# EAGLE design Adafruit NeoPixel Ring 24 B (EAGLE 6.3)
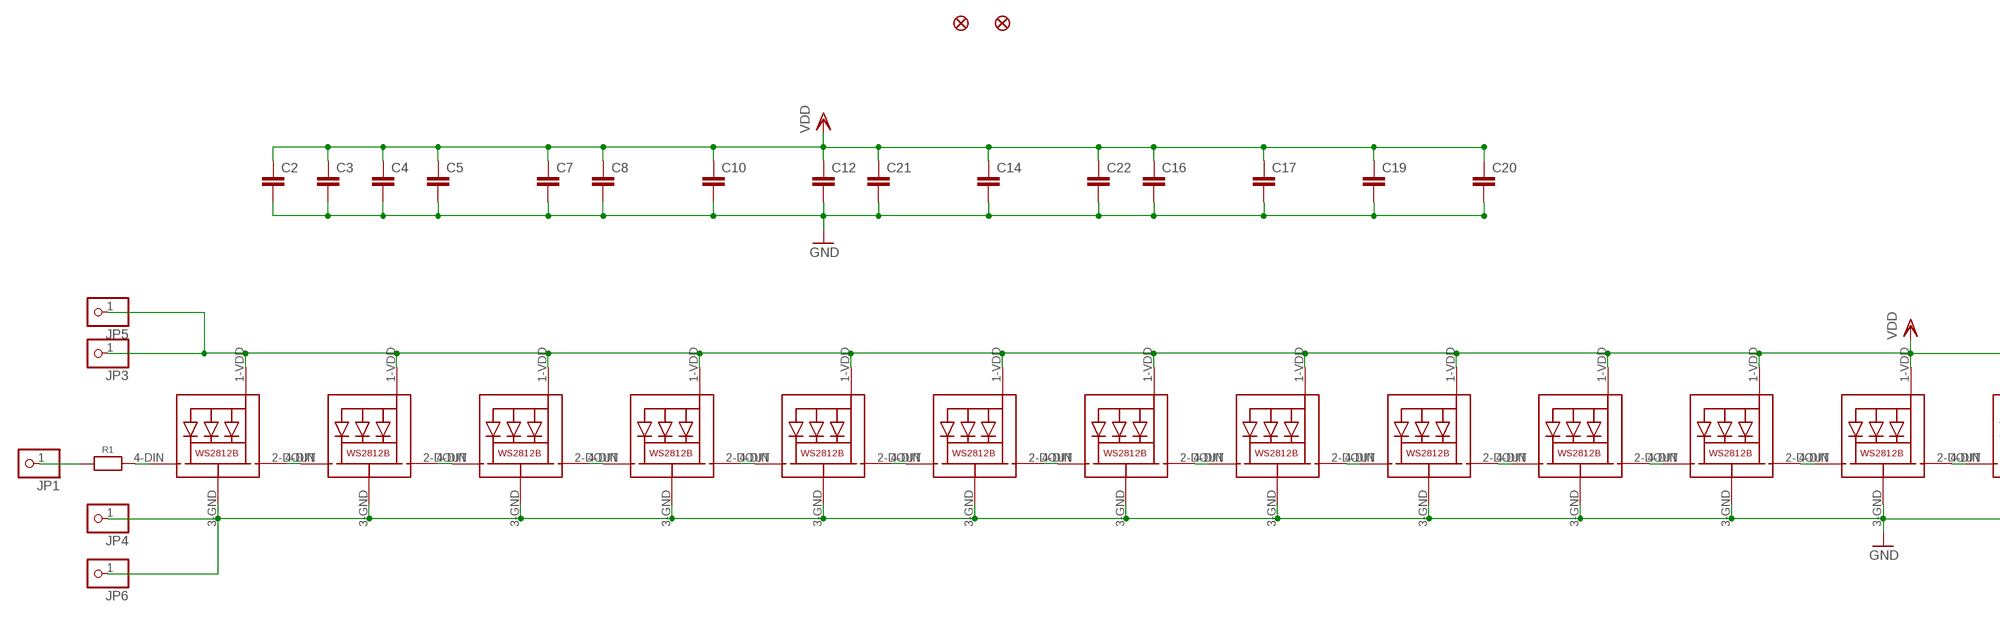
[diagram p0: schematic, sheet 1, part 1 of 2]
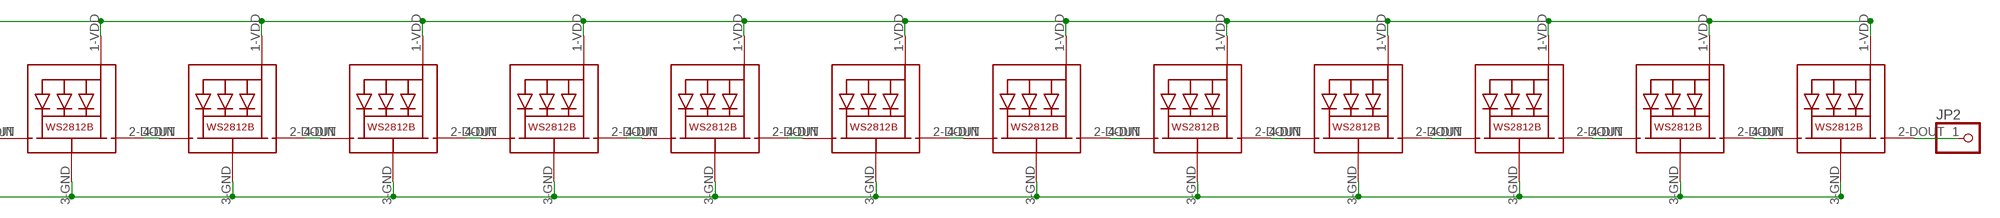
[diagram p1: schematic, sheet 1, part 2 of 2]

## Parts
C2  C-EUC0603  [C0603]
C3  C-EUC0603  [C0603]
C4  C-EUC0603  [C0603]
C5  C-EUC0603  [C0603]
C7  C-EUC0603  [C0603]
C8  C-EUC0603  [C0603]
C10  C-EUC0603  [C0603]
C12  C-EUC0603  [C0603]
C14  C-EUC0603  [C0603]
C16  C-EUC0603  [C0603]
C17  C-EUC0603  [C0603]
C19  C-EUC0603  [C0603]
C20  C-EUC0603  [C0603]
C21  C-EUC0603  [C0603]
C22  C-EUC0603  [C0603]
FID1  FIDUCIAL""  [FIDUCIAL_1MM]
FID2  FIDUCIAL""  [FIDUCIAL_1MM]
JP1  PINHD-1X1CB  [1X01-CLEANBIG]
JP2  PINHD-1X1CB  [1X01-CLEANBIG]
JP3  PINHD-1X1CB  [1X01-CLEANBIG]
JP4  PINHD-1X1CB  [1X01-CLEANBIG]
JP5  PINHD-1X1CB  [1X01-CLEANBIG]
JP6  PINHD-1X1CB  [1X01-CLEANBIG]
LED1  WS2812B5050  [WS2812B]
LED2  WS2812B5050  [WS2812B]
LED3  WS2812B5050  [WS2812B]
LED4  WS2812B5050  [WS2812B]
LED5  WS2812B5050  [WS2812B]
LED6  WS2812B5050  [WS2812B]
LED7  WS2812B5050  [WS2812B]
LED8  WS2812B5050  [WS2812B]
LED9  WS2812B5050  [WS2812B]
LED10  WS2812B5050  [WS2812B]
LED11  WS2812B5050  [WS2812B]
LED12  WS2812B5050  [WS2812B]
LED13  WS2812B5050  [WS2812B]
LED14  WS2812B5050  [WS2812B]
LED15  WS2812B5050  [WS2812B]
LED16  WS2812B5050  [WS2812B]
LED17  WS2812B5050  [WS2812B]
LED18  WS2812B5050  [WS2812B]
LED19  WS2812B5050  [WS2812B]
LED20  WS2812B5050  [WS2812B]
LED21  WS2812B5050  [WS2812B]
LED22  WS2812B5050  [WS2812B]
LED23  WS2812B5050  [WS2812B]
LED24  WS2812B5050  [WS2812B]
R1  RESISTOR_0603_NOOUT  [0603-NO]

## Nets
GND: C2.2 C3.2 C4.2 C5.2 C7.2 C8.2 C10.2 C12.2 C14.2 C16.2 C17.2 C19.2 C20.2 C21.2 C22.2 JP4.1 JP6.1 LED1.3-GND(GND) LED2.3-GND(GND) LED3.3-GND(GND) LED4.3-GND(GND) LED5.3-GND(GND) LED6.3-GND(GND) LED7.3-GND(GND) LED8.3-GND(GND) LED9.3-GND(GND) LED10.3-GND(GND) LED11.3-GND(GND) LED12.3-GND(GND) LED13.3-GND(GND) LED14.3-GND(GND) LED15.3-GND(GND) LED16.3-GND(GND) LED17.3-GND(GND) LED18.3-GND(GND) LED19.3-GND(GND) LED20.3-GND(GND) LED21.3-GND(GND) LED22.3-GND(GND) LED23.3-GND(GND) LED24.3-GND(GND)
N$1: LED1.2-DOUT(DO) LED2.4-DIN(DI)
N$2: LED2.2-DOUT(DO) LED3.4-DIN(DI)
N$3: LED3.2-DOUT(DO) LED4.4-DIN(DI)
N$4: LED4.2-DOUT(DO) LED5.4-DIN(DI)
N$5: LED5.2-DOUT(DO) LED6.4-DIN(DI)
N$6: LED6.2-DOUT(DO) LED7.4-DIN(DI)
N$7: LED7.2-DOUT(DO) LED8.4-DIN(DI)
N$8: LED8.2-DOUT(DO) LED9.4-DIN(DI)
N$9: LED9.2-DOUT(DO) LED10.4-DIN(DI)
N$10: LED10.2-DOUT(DO) LED11.4-DIN(DI)
N$11: LED11.2-DOUT(DO) LED12.4-DIN(DI)
N$12: LED12.2-DOUT(DO) LED13.4-DIN(DI)
N$13: LED13.2-DOUT(DO) LED14.4-DIN(DI)
N$14: LED14.2-DOUT(DO) LED15.4-DIN(DI)
N$15: LED15.2-DOUT(DO) LED16.4-DIN(DI)
N$16: LED16.2-DOUT(DO) LED17.4-DIN(DI)
N$17: LED17.2-DOUT(DO) LED18.4-DIN(DI)
N$18: LED18.2-DOUT(DO) LED19.4-DIN(DI)
N$19: LED19.2-DOUT(DO) LED20.4-DIN(DI)
N$20: LED20.2-DOUT(DO) LED21.4-DIN(DI)
N$21: LED21.2-DOUT(DO) LED22.4-DIN(DI)
N$22: LED22.2-DOUT(DO) LED23.4-DIN(DI)
N$23: LED23.2-DOUT(DO) LED24.4-DIN(DI)
N$24: JP2.1 LED24.2-DOUT(DO)
N$25: LED1.4-DIN(DI) R1.2
N$26: JP1.1 R1.1
VDD: C2.1 C3.1 C4.1 C5.1 C7.1 C8.1 C10.1 C12.1 C14.1 C16.1 C17.1 C19.1 C20.1 C21.1 C22.1 JP3.1 JP5.1 LED1.1-VDD(VDD) LED2.1-VDD(VDD) LED3.1-VDD(VDD) LED4.1-VDD(VDD) LED5.1-VDD(VDD) LED6.1-VDD(VDD) LED7.1-VDD(VDD) LED8.1-VDD(VDD) LED9.1-VDD(VDD) LED10.1-VDD(VDD) LED11.1-VDD(VDD) LED12.1-VDD(VDD) LED13.1-VDD(VDD) LED14.1-VDD(VDD) LED15.1-VDD(VDD) LED16.1-VDD(VDD) LED17.1-VDD(VDD) LED18.1-VDD(VDD) LED19.1-VDD(VDD) LED20.1-VDD(VDD) LED21.1-VDD(VDD) LED22.1-VDD(VDD) LED23.1-VDD(VDD) LED24.1-VDD(VDD)

## Library data of the parts
C2-C5 C7 C8 C10 C12 C14 C16 C17 C19-C22 = rcl:C-EU: CAPACITOR, European symbol
FID1 FID2 = microbuilder:FIDUCIAL: Fiducial Alignment Points Various fiducial points for machine vision alignment.; BOM: EXCLUDE
JP1-JP6 = NeoPixelRing:PINHD-1X1: Pin header 1x1 for 0.1" spacing With round pins
LED1-LED24 = microbuilder:WS2812B5050
R1 = microbuilder:RESISTOR: Resistors For new designs, use the packages preceded by an '_' character since they are more reliable: The following footprints should be used on most boards: _0402 - Standard footprint for regular board layouts _0603 - Standard footprint for regular board layouts _0805 - Standard footprint for regular board layouts _1206 - Standard footprint for regular board layouts For extremely tight-pitch boards where space is at a premium, the following 'micro-pitch' footprints can be used (smaller pads, no silkscreen outline, etc.): _0402MP - Micro-pitch footprint for very dense/compact boards _0603MP - Micro-pitch footprint for very dense/compact boards _0805MP - Micro-pitch footprint for very dense/compact boards _1206MP - Micro-pitch footprint for very dense/compact boards

## Board
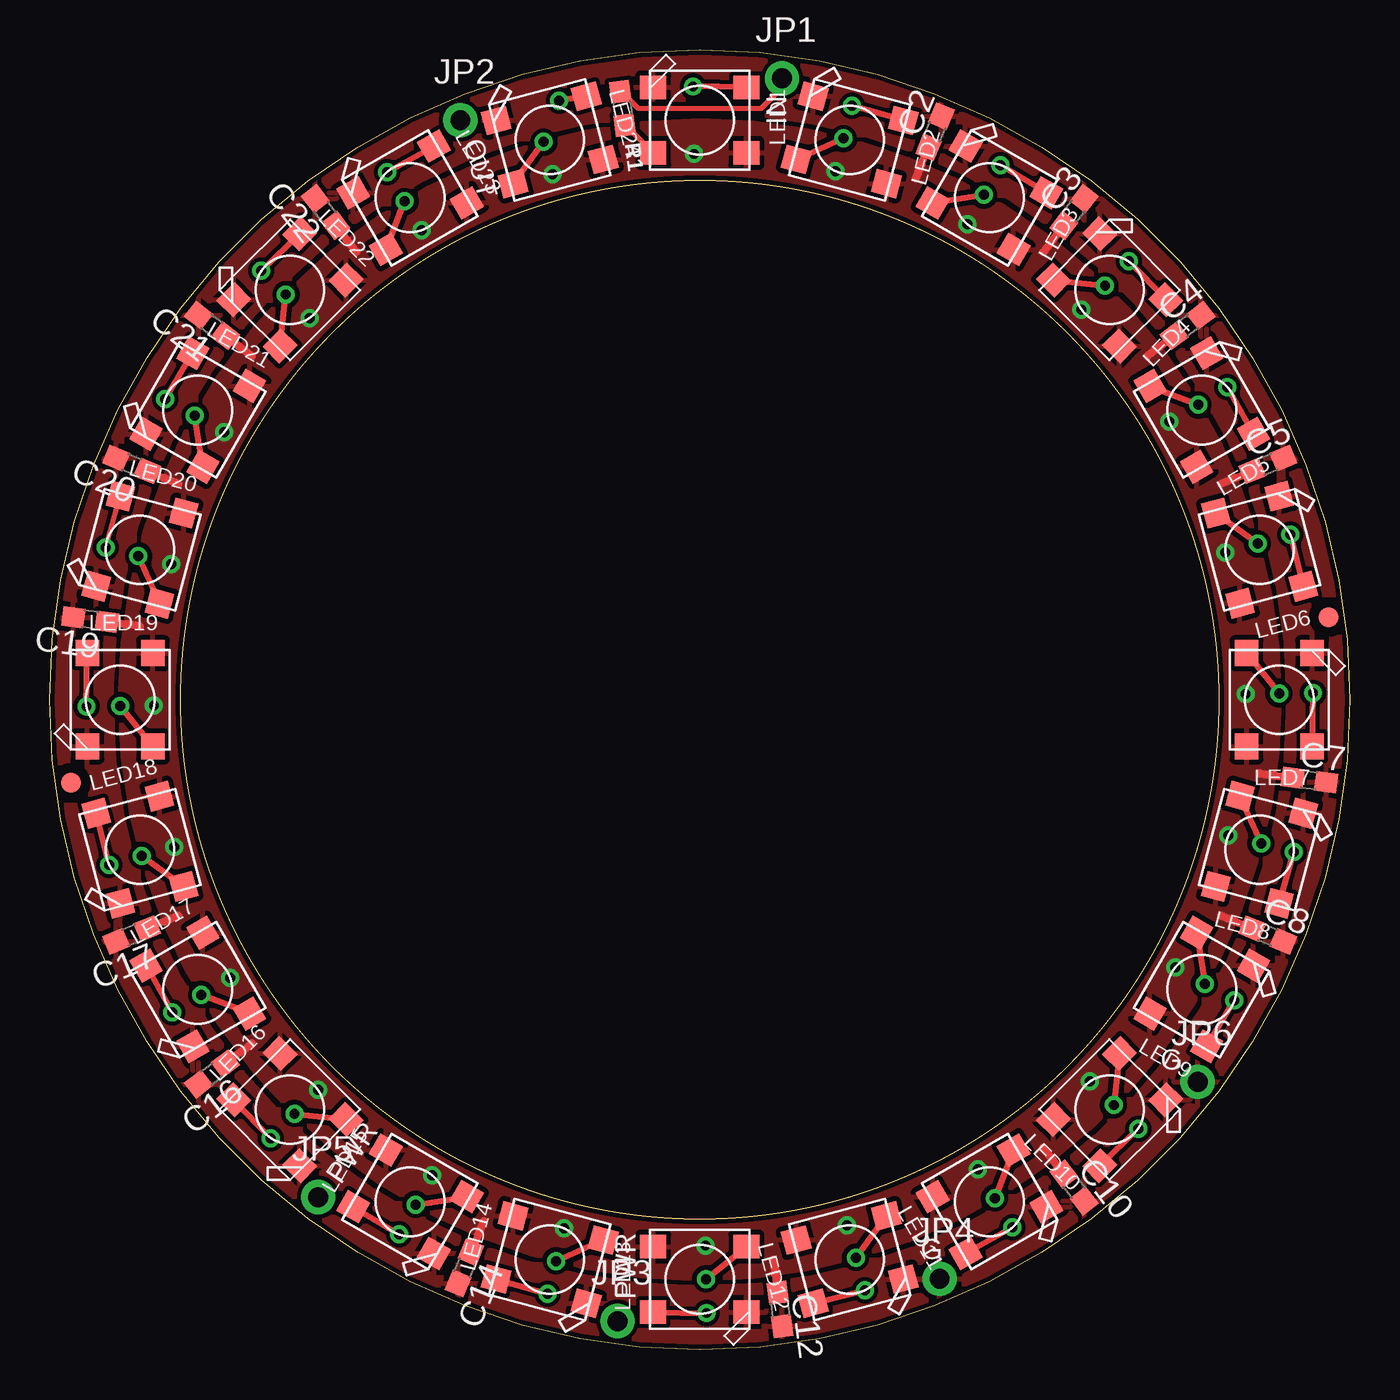
[diagram p2: board, top side]
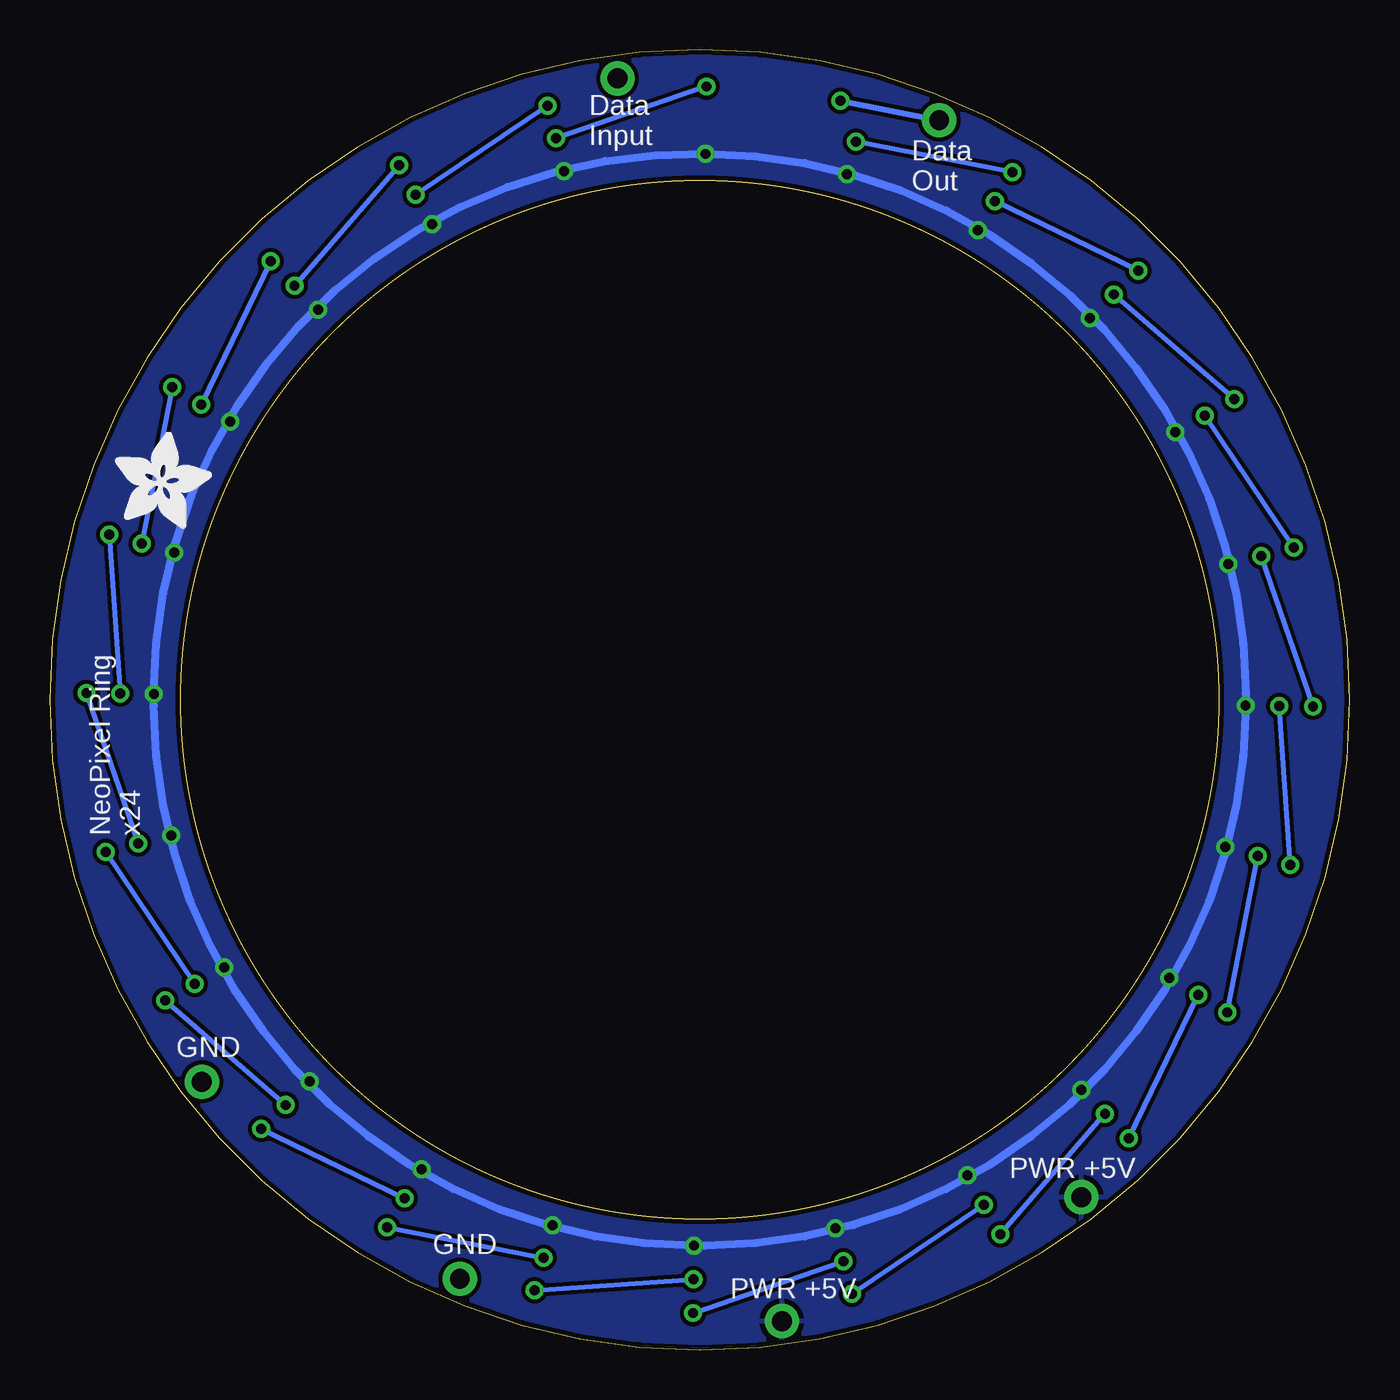
[diagram p3: board, bottom side, seen from below]

Size 65.53 x 65.53 mm. Coordinates in mm from the lower left corner, seen from the top.
Outline: 0,32.77 arc-90 32.77,65.53 arc-90 65.53,32.77 arc-90 32.77,0 arc-90 0,32.77
Outline: circle at 32.77,32.77 radius 26.16
Copper layers (1*16): Top 0.035mm / dielectric 1.5mm / Bottom 0.035mm
Design rules "adafruit": minimum track width 8mil, minimum drill 15.5mil, track to track 8mil, track to pad 8mil, pad to pad 8mil, via to via 8mil, smd to smd 8mil, copper to edge 10mil, drill to drill 8mil, minimum pad ring 10mil, minimum via ring 8mil, stop-mask expansion 4mil, vias tented up to drill 20mil, thermal gap 10mil

### Footprints (pad centres in the part's own frame; a part is rotated, then mirrored left to right if it is on the bottom)
C0603 = smd 1.1 x 1: 1 -0.85,0; 2 0.85,0
FIDUCIAL_1MM = smd 1 x 1: 1 0,0
1X01-CLEANBIG = drill 1 pad 1.727: 1 0,0
WS2812B-NARROW = smd 1.3 x 1.2: 1-VDD 2.35,-1.65; 2-DOUT 2.35,1.65; 3-GND -2.35,1.65; 4-DIN -2.35,-1.65
0603-NO = smd 1.1 x 1: 1 -0.85,0; 2 0.85,0

### Placement (x,y rotation side)
C2  44.62,61.4 67.5 top
C3  51.63,57.35 52.5 top
C4  57.35,51.63 37.5 top
C5  61.4,44.62 22.5 top
C7  63.49,28.72 352.5 top
C8  61.4,20.91 337.5 top
C10  51.63,8.18 307.5 top
C12  36.81,2.04 277.5 top
C14  20.91,4.14 247.5 top
C16  8.18,13.9 217.5 top
C17  4.14,20.91 202.5 top
C19  2.04,36.81 172.5 top
C20  4.14,44.62 157.5 top
C21  8.18,51.63 142.5 top
C22  13.9,57.35 127.5 top
FID1  1.07,28.57 0 top
FID2  64.47,36.93 0 top
JP1  36.91,64.08 0 top
JP2  20.7,61.98 0 top
JP3  28.63,1.45 0 top
JP4  44.86,3.58 0 top
JP5  13.54,7.7 0 top
JP6  57.86,13.51 0 top
LED1  WS2812B5050  [WS2812B-NARROW]  32.77,61.98 0 top
LED2  WS2812B5050  [WS2812B-NARROW]  40.33,60.98 345 top
LED3  WS2812B5050  [WS2812B-NARROW]  47.37,58.06 330 top
LED4  WS2812B5050  [WS2812B-NARROW]  53.42,53.42 315 top
LED5  WS2812B5050  [WS2812B-NARROW]  58.06,47.37 300 top
LED6  WS2812B5050  [WS2812B-NARROW]  60.98,40.33 285 top
LED7  WS2812B5050  [WS2812B-NARROW]  61.98,32.77 270 top
LED8  WS2812B5050  [WS2812B-NARROW]  60.98,25.21 255 top
LED9  WS2812B5050  [WS2812B-NARROW]  58.06,18.16 240 top
LED10  WS2812B5050  [WS2812B-NARROW]  53.42,12.11 225 top
LED11  WS2812B5050  [WS2812B-NARROW]  47.37,7.47 210 top
LED12  WS2812B5050  [WS2812B-NARROW]  40.33,4.55 195 top
LED13  WS2812B5050  [WS2812B-NARROW]  32.77,3.56 180 top
LED14  WS2812B5050  [WS2812B-NARROW]  25.21,4.55 165 top
LED15  WS2812B5050  [WS2812B-NARROW]  18.16,7.47 150 top
LED16  WS2812B5050  [WS2812B-NARROW]  12.11,12.11 135 top
LED17  WS2812B5050  [WS2812B-NARROW]  7.47,18.16 120 top
LED18  WS2812B5050  [WS2812B-NARROW]  4.55,25.21 105 top
LED19  WS2812B5050  [WS2812B-NARROW]  3.56,32.77 90 top
LED20  WS2812B5050  [WS2812B-NARROW]  4.55,40.33 75 top
LED21  WS2812B5050  [WS2812B-NARROW]  7.47,47.37 60 top
LED22  WS2812B5050  [WS2812B-NARROW]  12.11,53.42 45 top
LED23  WS2812B5050  [WS2812B-NARROW]  18.16,58.06 30 top
LED24  WS2812B5050  [WS2812B-NARROW]  25.21,60.98 15 top
R1  28.87,62.57 277.5 top
U$1  [ADAFRUIT_5MM]  62.23,41.4 0 bottom

### Tracks (layer width: path | path; a pad name or v marks a point on that pad's centre or on a via)
GND
  pour Top (rank 2): -0.25,66.04 0.51,-0.76 66.29,-1.27 65.53,65.53
N$1  (via drill 0.5)
  Top 0.305: LED2.4-DIN v40.02,61.06 | LED1.2-DOUT v32.43,63.67
  Bottom 0.254: v32.43,63.67 v40.02,61.06
N$2  (via drill 0.5)
  Top 0.305: LED2.2-DOUT v40.44,62.71 | LED3.4-DIN v47.09,58.22
  Bottom 0.254: v40.44,62.71 v47.09,58.22
N$3  (via drill 0.5)
  Top 0.305: LED3.2-DOUT v47.93,59.7 | LED4.4-DIN v53.19,53.64
  Bottom 0.254: v47.93,59.7 v53.19,53.64
N$4  (via drill 0.5)
  Top 0.305: LED4.2-DOUT v54.38,54.86 | LED5.4-DIN v57.9,47.65
  Bottom 0.254: v54.38,54.86 v57.9,47.65
N$5  (via drill 0.5)
  Top 0.305: v59.36,48.51 LED5.2-DOUT | LED6.4-DIN v60.9,40.63
  Bottom 0.254: v59.36,48.51 v60.9,40.63
N$6  (via drill 0.5)
  Top 0.305: v62.53,41.09 LED6.2-DOUT | LED7.4-DIN v61.97,33.09
  Bottom 0.254: v62.53,41.09 v61.97,33.09
N$7  (via drill 0.5)
  Top 0.305: LED7.2-DOUT v63.67,33.1 | LED8.4-DIN v61.06,25.51
  Bottom 0.254: v63.67,33.1 v61.06,25.51
N$8  (via drill 0.5)
  Top 0.305: LED8.2-DOUT v62.71,25.09 | LED9.4-DIN v58.22,18.44
  Bottom 0.254: v62.71,25.09 v58.22,18.44
N$9  (via drill 0.5)
  Top 0.305: LED9.2-DOUT v59.7,17.6 | LED10.4-DIN v53.64,12.34
  Bottom 0.254: v59.7,17.6 v53.64,12.34
N$10  (via drill 0.5)
  Top 0.305: LED10.2-DOUT v54.86,11.15 | LED11.4-DIN v47.65,7.63
  Bottom 0.254: v54.86,11.15 v47.65,7.63
N$11  (via drill 0.5)
  Top 0.305: LED11.2-DOUT v48.51,6.17 | v40.63,4.63 LED12.4-DIN
  Bottom 0.254: v48.51,6.17 v40.63,4.63
N$12  (via drill 0.5)
  Top 0.305: v33.09,3.56 LED13.4-DIN | LED12.2-DOUT v41.09,3
  Bottom 0.254: v41.09,3 v33.09,3.56
N$13  (via drill 0.5)
  Top 0.305: LED13.2-DOUT v33.1,1.86 | v25.51,4.47 LED14.4-DIN
  Bottom 0.254: v33.1,1.86 v25.51,4.47
N$14  (via drill 0.5)
  Top 0.305: LED14.2-DOUT v25.09,2.82 | v18.44,7.31 LED15.4-DIN
  Bottom 0.254: v25.09,2.82 v18.44,7.31
N$15  (via drill 0.5)
  Top 0.305: LED15.2-DOUT v17.6,5.83 | v12.34,11.89 LED16.4-DIN
  Bottom 0.254: v17.6,5.83 v12.34,11.89
N$16  (via drill 0.5)
  Top 0.305: LED16.2-DOUT v11.15,10.67 | LED17.4-DIN v7.63,17.89
  Bottom 0.254: v11.15,10.67 v7.63,17.89
N$17  (via drill 0.5)
  Top 0.305: LED17.2-DOUT v6.17,17.02 | LED18.4-DIN v4.63,24.9
  Bottom 0.254: v6.17,17.02 v4.63,24.9
N$18  (via drill 0.5)
  Top 0.305: v3,24.44 LED18.2-DOUT | v3.56,32.45 LED19.4-DIN
  Bottom 0.254: v3,24.44 v3.56,32.45
N$19  (via drill 0.5)
  Top 0.305: v1.86,32.43 LED19.2-DOUT | LED20.4-DIN v4.47,40.02
  Bottom 0.254: v1.86,32.43 v4.47,40.02
N$20  (via drill 0.5)
  Top 0.254: v2.82,40.44 LED20.2-DOUT
  Top 0.305: LED21.4-DIN v7.31,47.09
  Bottom 0.254: v2.82,40.44 v7.31,47.09
N$21  (via drill 0.5)
  Top 0.305: v5.83,47.93 LED21.2-DOUT | LED22.4-DIN v11.89,53.19
  Bottom 0.254: v5.83,47.93 v11.89,53.19
N$22  (via drill 0.5)
  Top 0.305: LED22.2-DOUT v10.67,54.38 | LED23.4-DIN v17.89,57.9
  Bottom 0.254: v10.67,54.38 v17.89,57.9
N$23  (via drill 0.5)
  Top 0.305: LED24.4-DIN v24.9,60.9 | v17.02,59.36 LED23.2-DOUT
  Bottom 0.254: v17.02,59.36 v24.9,60.9
N$24  (via drill 0.5)
  Top 0.305: LED24.2-DOUT v25.67,62.97
  Bottom 0.305: v25.67,62.97 JP2.1
N$25
  Top 0.254: R1.2 29.02,61.72 LED1.4-DIN
N$26
  Top 0.254: R1.1 28.82,63.41 29.67,62.57 35.87,62.57 36.77,63.47 36.77,63.94 JP1.1
VDD  (via drill 0.5)
  Top 0.406: 43.65,59.05 43.94,59.75 C2.1 | 50.08,55.33 50.55,55.94 C3.1 | 55.33,50.08 55.94,50.55 C4.1 | 59.05,43.65 59.75,43.94 C5.1 | 60.97,29.05 61.73,28.95 C7.1 | 59.05,21.88 59.75,21.59 C8.1 | 50.08,10.2 50.55,9.59 C10.1 | 36.48,4.56 36.58,3.81 C12.1 | 21.88,6.48 21.59,5.78 C14.1 | 10.2,15.45 9.59,14.98 C16.1 | 6.48,21.88 5.78,21.59 C17.1 | 4.56,36.48 3.81,36.58 C19.1 | 6.48,43.65 5.78,43.94 C20.1 | 10.2,50.08 9.59,50.55 C21.1 | 15.45,55.33 14.98,55.94 C22.1
  Bottom 0.406: v32.47,60.27 arc90 5.26,33.07 v5.26,32.47 arc90 32.47,5.26 v33.07,5.26 arc90 60.27,32.47 v60.27,33.07 arc91 v32.47,60.27
  other vias: 39.6,59.41 46.26,56.74 52.01,52.43 56.44,46.78 59.26,40.18 59.41,25.94 56.74,19.27 52.43,13.53 46.78,9.09 40.18,6.27 25.94,6.12 19.27,8.79 13.53,13.1 9.09,18.75 6.27,25.36 6.12,39.6 8.79,46.26 13.1,52.01 18.75,56.44 25.36,59.26
  pour Bottom: 0.25,66.04 -0.51,-1.27 66.29,-1.02 67.06,66.29
  pour Top (isolate 0.254): 32.77,61.97 arc-90 61.97,32.77 arc-90 32.77,3.57 arc-180

### Text on the board
tPlace: IN | OUT | G | PWR | G | PWR
bPlace: Data / Input | Data / Out | NeoPixel Ring / x24 | GND | PWR +5V | GND | PWR +5V